# Altium schematic sheet EPS_VBAT.SchDoc: VBAT
size A4
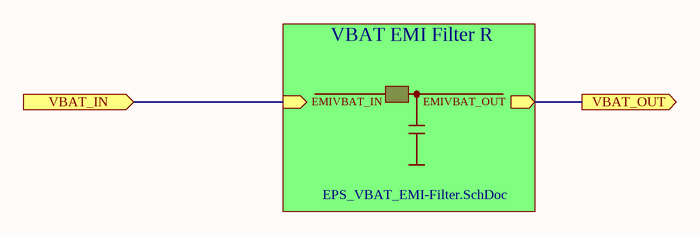
[diagram p0: EPS_VBAT.SchDoc]

## Sub-sheets
VBAT EMI Filter R = EPS_VBAT_EMI-Filter.SchDoc: EMIVBAT_OUT (out), EMIVBAT_IN (in)

## Ports
VBAT_IN (in), VBAT_OUT (out)

## Nets
VBAT_IN: port VBAT_IN, sheet VBAT EMI Filter R/EMIVBAT_IN
VBAT_OUT: port VBAT_OUT, sheet VBAT EMI Filter R/EMIVBAT_OUT

## Notes on the sheet
- Title:
- Project:
- Author:
- Model:
- Document Number:
- Checked by:
- Rev:
- Date:
- Approved by:
- Sheet:
- of
- File name: